# EAGLE schematic main1 (EAGLE 8.0.0)
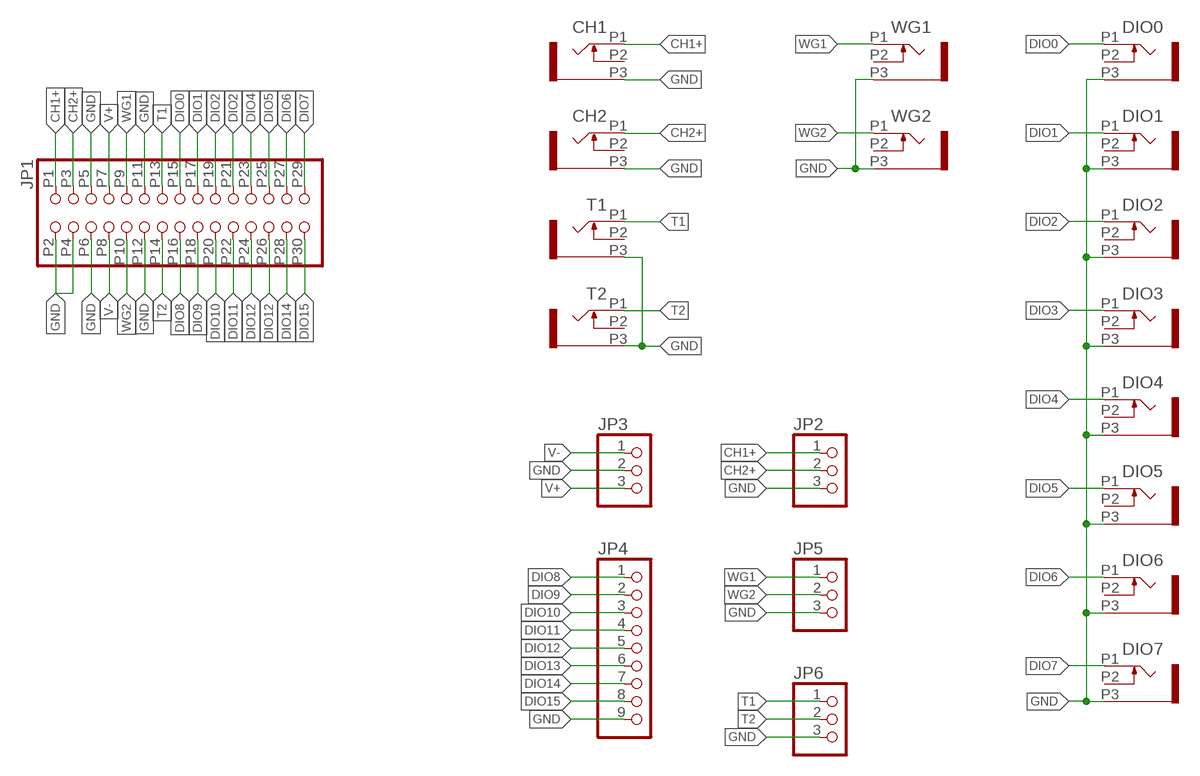
[diagram p0: schematic, sheet 1]

## Parts
CH1  THONKICONN  [WQP-PJ301M-12_JACK]
CH2  THONKICONN  [WQP-PJ301M-12_JACK]
DIO0  THONKICONN  [WQP-PJ301M-12_JACK]
DIO1  THONKICONN  [WQP-PJ301M-12_JACK]
DIO2  THONKICONN  [WQP-PJ301M-12_JACK]
DIO3  THONKICONN  [WQP-PJ301M-12_JACK]
DIO4  THONKICONN  [WQP-PJ301M-12_JACK]
DIO5  THONKICONN  [WQP-PJ301M-12_JACK]
DIO6  THONKICONN  [WQP-PJ301M-12_JACK]
DIO7  THONKICONN  [WQP-PJ301M-12_JACK]
JP1  PINHD-2X15  [2X15/EDGE]
JP2  PINHD-1X3/OCT  [1X03/OCT]
JP3  PINHD-1X3/OCT  [1X03/OCT]
JP4  PINHD-1X9/OCT  [1X09/OCT]
JP5  PINHD-1X3/OCT  [1X03/OCT]
JP6  PINHD-1X3/OCT  [1X03/OCT]
T1  THONKICONN  [WQP-PJ301M-12_JACK]
T2  THONKICONN  [WQP-PJ301M-12_JACK]
WG1  THONKICONN  [WQP-PJ301M-12_JACK]
WG2  THONKICONN  [WQP-PJ301M-12_JACK]

## Nets
CH1+: CH1.P1 JP1.P1 JP2.1
CH2+: CH2.P1 JP1.P3 JP2.2
DIO0: DIO0.P1 JP1.P15
DIO1: DIO1.P1 JP1.P17
DIO2: DIO2.P1 JP1.P19
DIO3: DIO3.P1 JP1.P21
DIO4: DIO4.P1 JP1.P23
DIO5: DIO5.P1 JP1.P25
DIO6: DIO6.P1 JP1.P27
DIO7: DIO7.P1 JP1.P29
DIO8: JP1.P16 JP4.1
DIO9: JP1.P18 JP4.2
DIO10: JP1.P20 JP4.3
DIO11: JP1.P22 JP4.4
DIO12: JP1.P24 JP4.5
DIO13: JP1.P26 JP4.6
DIO14: JP1.P28 JP4.7
DIO15: JP1.P30 JP4.8
GND: CH1.P3 CH2.P3 DIO0.P3 DIO1.P3 DIO2.P3 DIO3.P3 DIO4.P3 DIO5.P3 DIO6.P3 DIO7.P3 JP1.P2 JP1.P4 JP1.P5 JP1.P6 JP1.P11 JP1.P12 JP2.3 JP3.2 JP4.9 JP5.3 JP6.3 T1.P3 T2.P3 WG1.P3 WG2.P3
T1: JP1.P13 JP6.1 T1.P1
T2: JP1.P14 JP6.2 T2.P1
V+: JP1.P7 JP3.3
V-: JP1.P8 JP3.1
WG1: JP1.P9 JP5.1 WG1.P1
WG2: JP1.P10 JP5.2 WG2.P1
Unconnected: CH1.P2 CH2.P2 DIO0.P2 DIO1.P2 DIO2.P2 DIO3.P2 DIO4.P2 DIO5.P2 DIO6.P2 DIO7.P2 T1.P2 T2.P2 WG1.P2 WG2.P2

## Library data of the parts
CH1 CH2 DIO0 DIO1-DIO7 T1 T2 WG1 WG2 = _JC:THONKICONN
JP1 = _JC:PINHD-2X15: PIN HEADER
JP2 JP3 JP5 JP6 = _JC:PINHD-1X3: PIN HEADER
JP4 = _JC:PINHD-1X9: PIN HEADER